# Altium schematic sheet FPGA_PWR.SchDoc
size A4; SheetNumber: 11; SheetTotal: 14
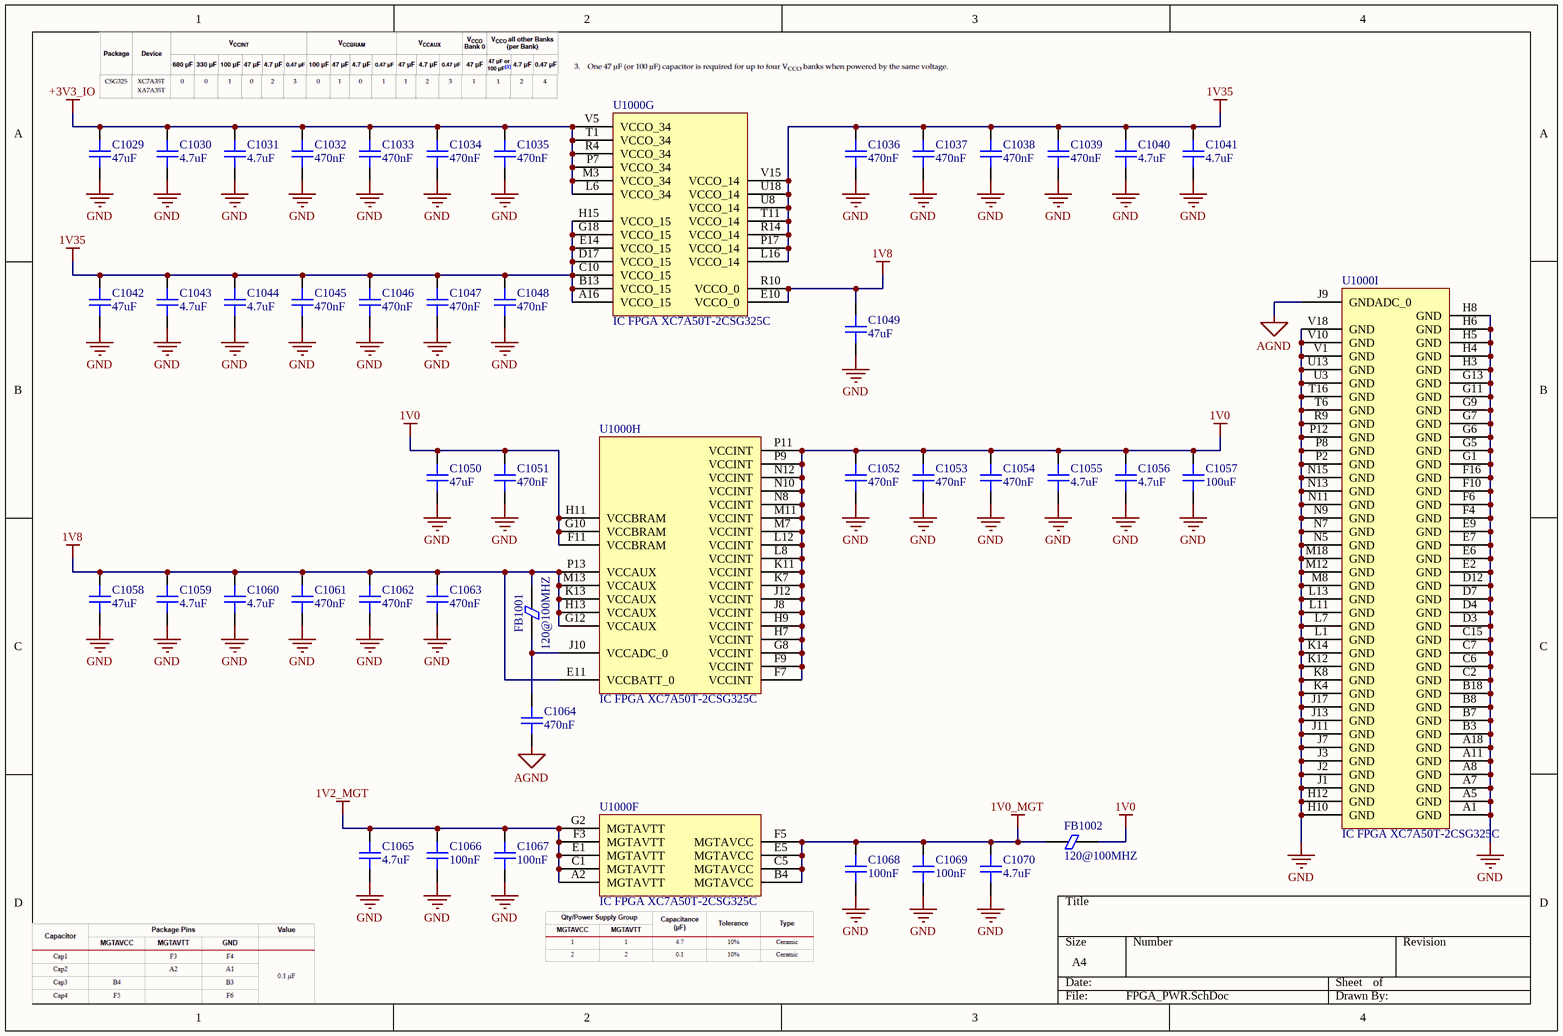
[diagram p0: FPGA_PWR.SchDoc]

## Parts
C1029  47uF  [GEN_C_0805]
C1030  4.7uF  [GEN_C_0402]
C1031  4.7uF  [GEN_C_0402]
C1032  470nF  [GEN_C_0201]
C1033  470nF  [GEN_C_0201]
C1034  470nF  [GEN_C_0201]
C1035  470nF  [GEN_C_0201]
C1036  470nF  [GEN_C_0201]
C1037  470nF  [GEN_C_0201]
C1038  470nF  [GEN_C_0201]
C1039  470nF  [GEN_C_0201]
C1040  4.7uF  [GEN_C_0402]
C1041  4.7uF  [GEN_C_0402]
C1042  47uF  [GEN_C_0805]
C1043  4.7uF  [GEN_C_0402]
C1044  4.7uF  [GEN_C_0402]
C1045  470nF  [GEN_C_0201]
C1046  470nF  [GEN_C_0201]
C1047  470nF  [GEN_C_0201]
C1048  470nF  [GEN_C_0201]
C1049  47uF  [GEN_C_0805]
C1050  47uF  [GEN_C_0805]
C1051  470nF  [GEN_C_0201]
C1052  470nF  [GEN_C_0201]
C1053  470nF  [GEN_C_0201]
C1054  470nF  [GEN_C_0201]
C1055  4.7uF  [GEN_C_0402]
C1056  4.7uF  [GEN_C_0402]
C1057  100uF  [GEN_C_1210]
C1058  47uF  [GEN_C_0805]
C1059  4.7uF  [GEN_C_0402]
C1060  4.7uF  [GEN_C_0402]
C1061  470nF  [GEN_C_0201]
C1062  470nF  [GEN_C_0201]
C1063  470nF  [GEN_C_0201]
C1064  470nF  [GEN_C_0201]
C1065  4.7uF  [GEN_C_0402]
C1066  100nF  [GEN_C_0201]
C1067  100nF  [GEN_C_0201]
C1068  100nF  [GEN_C_0201]
C1069  100nF  [GEN_C_0201]
C1070  4.7uF  [GEN_C_0402]
FB1001  120@100MHZ  [GEN_R_0402]
FB1002  120@100MHZ  [GEN_R_0402]
U1000  IC FPGA XC7A50T-2CSG325C  [XILINX_XC7A50T-2CSG325C]  (parts F,G,H,I of 9)

## Nets
1V0: C1050.2 C1051.2 C1052.2 C1053.2 C1054.2 C1055.2 C1056.2 C1057.2 FB1002.1 U1000.F7(VCCINT) U1000.F9(VCCINT) U1000.F11(VCCBRAM) U1000.G8(VCCINT) U1000.G10(VCCBRAM) U1000.H7(VCCINT) U1000.H9(VCCINT) U1000.H11(VCCBRAM) U1000.J8(VCCINT) U1000.J12(VCCINT) U1000.K7(VCCINT) U1000.K11(VCCINT) U1000.L8(VCCINT) U1000.L12(VCCINT) U1000.M7(VCCINT) U1000.M11(VCCINT) U1000.N8(VCCINT) U1000.N10(VCCINT) U1000.N12(VCCINT) U1000.P9(VCCINT) U1000.P11(VCCINT)
1V0_MGT: C1068.2 C1069.2 C1070.2 FB1002.2 U1000.B4(MGTAVCC) U1000.C5(MGTAVCC) U1000.E5(MGTAVCC) U1000.F5(MGTAVCC)
1V2_MGT: C1065.2 C1066.2 C1067.2 U1000.A2(MGTAVTT) U1000.C1(MGTAVTT) U1000.E1(MGTAVTT) U1000.F3(MGTAVTT) U1000.G2(MGTAVTT)
1V8: C1049.2 C1058.2 C1059.2 C1060.2 C1061.2 C1062.2 C1063.2 FB1001.2 U1000.E10(VCCO_0) U1000.E11(VCCBATT_0) U1000.G12(VCCAUX) U1000.H13(VCCAUX) U1000.K13(VCCAUX) U1000.M13(VCCAUX) U1000.P13(VCCAUX) U1000.R10(VCCO_0)
1V35: C1036.2 C1037.2 C1038.2 C1039.2 C1040.2 C1041.2 C1042.2 C1043.2 C1044.2 C1045.2 C1046.2 C1047.2 C1048.2 U1000.A16(VCCO_15) U1000.B13(VCCO_15) U1000.C10(VCCO_15) U1000.D17(VCCO_15) U1000.E14(VCCO_15) U1000.G18(VCCO_15) U1000.H15(VCCO_15) U1000.L16(VCCO_14) U1000.P17(VCCO_14) U1000.R14(VCCO_14) U1000.T11(VCCO_14) U1000.U8(VCCO_14) U1000.U18(VCCO_14) U1000.V15(VCCO_14)
+3V3_IO: C1029.2 C1030.2 C1031.2 C1032.2 C1033.2 C1034.2 C1035.2 U1000.L6(VCCO_34) U1000.M3(VCCO_34) U1000.P7(VCCO_34) U1000.R4(VCCO_34) U1000.T1(VCCO_34) U1000.V5(VCCO_34)
AGND: C1064.1 U1000.J9(GNDADC_0)
GND: C1029.1 C1030.1 C1031.1 C1032.1 C1033.1 C1034.1 C1035.1 C1036.1 C1037.1 C1038.1 C1039.1 C1040.1 C1041.1 C1042.1 C1043.1 C1044.1 C1045.1 C1046.1 C1047.1 C1048.1 C1049.1 C1050.1 C1051.1 C1052.1 C1053.1 C1054.1 C1055.1 C1056.1 C1057.1 C1058.1 C1059.1 C1060.1 C1061.1 C1062.1 C1063.1 C1065.1 C1066.1 C1067.1 C1068.1 C1069.1 C1070.1 U1000.A1(GND) U1000.A5(GND) U1000.A7(GND) U1000.A8(GND) U1000.A11(GND) U1000.A18(GND) U1000.B3(GND) U1000.B7(GND) U1000.B8(GND) U1000.B18(GND) U1000.C2(GND) U1000.C6(GND) U1000.C7(GND) U1000.C15(GND) U1000.D3(GND) U1000.D4(GND) U1000.D7(GND) U1000.D12(GND) U1000.E2(GND) U1000.E6(GND) U1000.E7(GND) U1000.E9(GND) U1000.F4(GND) U1000.F6(GND) U1000.F10(GND) U1000.F16(GND) U1000.G1(GND) U1000.G5(GND) U1000.G6(GND) U1000.G7(GND) U1000.G9(GND) U1000.G11(GND) U1000.G13(GND) U1000.H3(GND) U1000.H4(GND) U1000.H5(GND) U1000.H6(GND) U1000.H8(GND) U1000.H10(GND) U1000.H12(GND) U1000.J1(GND) U1000.J2(GND) U1000.J3(GND) U1000.J7(GND) U1000.J11(GND) U1000.J13(GND) U1000.J17(GND) U1000.K4(GND) U1000.K8(GND) U1000.K12(GND) U1000.K14(GND) U1000.L1(GND) U1000.L7(GND) U1000.L11(GND) U1000.L13(GND) U1000.M8(GND) U1000.M12(GND) U1000.M18(GND) U1000.N5(GND) U1000.N7(GND) U1000.N9(GND) U1000.N11(GND) U1000.N13(GND) U1000.N15(GND) U1000.P2(GND) U1000.P8(GND) U1000.P12(GND) U1000.R9(GND) U1000.T6(GND) U1000.T16(GND) U1000.U3(GND) U1000.U13(GND) U1000.V1(GND) U1000.V10(GND) U1000.V18(GND)
NetC1064_2: C1064.2 FB1001.1 U1000.J10(VCCADC_0)

## Library data of the parts
C1029 C1042 C1049 C1050 C1058 = CAP 47uF 6.3V X5R 0805: House Part Number: C-47uF-0805-002; Manufacturer: Samsung; Manufacturer Part Number: CL21A476MQYNNNE; Voltage Rating: 6.3V; Package: 0805; Value: 47uF; Supplier 1: Mouser; Supplier Part Number 1: 187-CL32A226KPJNNNE
C1030 C1031 C1040 C1041 C1043 C1044 C1055 C1056 C1059 C1060 C1065 C1070 = CAP 4.7uF 6.3V X5R 0402: House Part Number: C-4.7uF-0402-002; Manufacturer: Murata; Manufacturer Part Number: GRM155R60J475ME47D; Voltage Rating: 6.3V; Package: 0402; Value: 4.7uF; Supplier 1: Mouser; Supplier Part Number 1: 81-GRM155R60J475ME7D
C1032-C1039 C1045-C1048 C1051-C1054 C1061-C1064 = CAP 470nF 6.3V X5R 0201: House Part Number: C-470nF-0201-002; Manufacturer: Murata; Manufacturer Part Number: GRM033R60J474KE90D; Voltage Rating: 6.3V; Package: 0201; Value: 470nF; Supplier 1: Mouser; Supplier Part Number 1: 81-GRM33R60J474KE90D
C1057 = CAP 100uF 6.3V X5R 1210: House Part Number: C-100uF-1210-002; Manufacturer: Samsung; Manufacturer Part Number: CL32A107MQVNNNE; Voltage Rating: 6.3V; Package: 1210; Value: 100uF; Supplier 1: Mouser; Supplier Part Number 1: 187-CL32A107MQVNNNE
C1066-C1069 = CAP 100nF 6.3V X5R 0201: House Part Number: C-100nF-0201-002; Manufacturer: Murata; Manufacturer Part Number: GRM033R60J104KE19D; Voltage Rating: 6.3V; Package: 0201; Supplier 1: Mouser; Supplier Part Number 1: 81-GRM033R60J104KE19; Value: 100nF
FB1001 FB1002 = FERRITE BEAD 120 OHM 0402: House Part Number: BLM15PX121SN1D; Manufacturer: Murata; Supplier 1: Mouser; Supplier Part Number 1: 81-BLM15PX121SN1D; Manufacturer Part Number: BLM15PX121SN1D
U1000 = IC FPGA XC7A50T-2CSG325C: Artix-7 FPGA, 150 User I/Os, 4 GTP, 324-Ball BGA, Speed Grade 2, Commercial Grade, Pb-Free; Manufacturer: Xilinx; House Part Number: XC7A50T-2CSG325C; Manufacturer Part Number: XC7A50T-2CSG325C; Supplier 1: Digi-Key; Supplier Part Number 1: 122-2193-ND